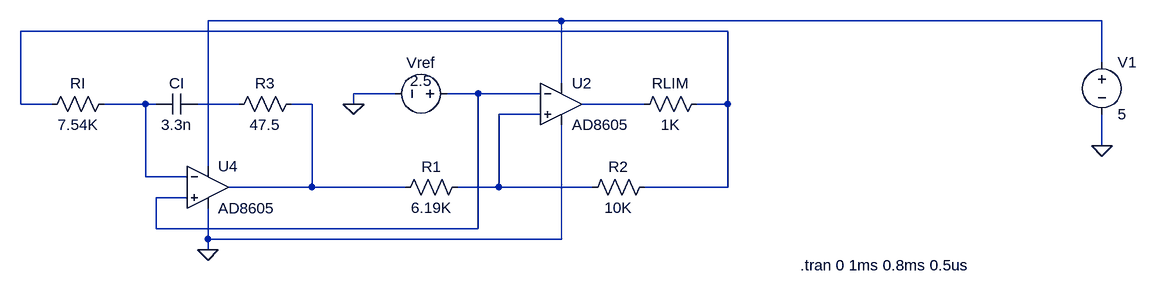
[diagram p0: schematic triangle_gen_final_ad8605.asc]
triangle_gen_final_ad8605.asc, the LTspice schematic file:
Version 4.1
SHEET 1 1528 680
WIRE 640 -48 96 -48
WIRE 1472 -48 640 -48
WIRE 896 -32 -192 -32
WIRE 1472 16 1472 -48
WIRE 640 48 640 -48
WIRE 384 64 320 64
WIRE 512 64 464 64
WIRE 608 64 512 64
WIRE -192 80 -192 -32
WIRE -144 80 -192 80
WIRE 0 80 -64 80
WIRE 16 80 0 80
WIRE 144 80 80 80
WIRE 256 80 224 80
WIRE 320 80 320 64
WIRE 768 80 672 80
WIRE 896 80 896 -32
WIRE 896 80 848 80
WIRE 608 96 544 96
WIRE 1472 144 1472 96
WIRE 96 176 96 -48
WIRE 0 192 0 80
WIRE 64 192 0 192
WIRE 256 208 256 80
WIRE 256 208 128 208
WIRE 400 208 256 208
WIRE 544 208 544 96
WIRE 544 208 480 208
WIRE 688 208 544 208
WIRE 896 208 896 80
WIRE 896 208 768 208
WIRE 64 224 16 224
WIRE 16 272 16 224
WIRE 512 272 512 64
WIRE 512 272 16 272
WIRE 96 288 96 240
WIRE 640 288 640 112
WIRE 640 288 96 288
WIRE 96 304 96 288
FLAG 320 80 0
FLAG 1472 144 0
FLAG 96 304 0
SYMBOL cap 80 64 R90
WINDOW 0 0 32 VBottom 2
WINDOW 3 32 32 VTop 2
SYMATTR InstName CI
SYMATTR Value 3.3n
SYMATTR SpiceLine V=50 Irms=0 Rser=0 Lser=0
SYMBOL res -48 64 R90
WINDOW 0 0 56 VBottom 2
WINDOW 3 32 56 VTop 2
SYMATTR InstName RI
SYMATTR Value 7.54K
SYMATTR SpiceLine tol=1 pwr=0.1
SYMBOL res 864 64 R90
WINDOW 0 0 56 VBottom 2
WINDOW 3 32 56 VTop 2
SYMATTR InstName RLIM
SYMATTR Value 1K
SYMATTR SpiceLine tol=1 pwr=0.1
SYMBOL res 784 192 R90
WINDOW 0 0 56 VBottom 2
WINDOW 3 32 56 VTop 2
SYMATTR InstName R2
SYMATTR Value 10K
SYMATTR SpiceLine tol=1 pwr=0.1
SYMBOL res 496 192 R90
WINDOW 0 0 56 VBottom 2
WINDOW 3 32 56 VTop 2
SYMATTR InstName R1
SYMATTR Value 6.19K
SYMATTR SpiceLine tol=1 pwr=0.1
SYMBOL voltage 480 64 R90
WINDOW 0 -32 56 VBottom 2
WINDOW 3 -4 56 VBottom 2
WINDOW 123 0 0 Left 0
WINDOW 39 0 0 Left 0
SYMATTR InstName Vref
SYMATTR Value 2.5
SYMBOL voltage 1472 0 R0
WINDOW 123 0 0 Left 0
WINDOW 39 0 0 Left 0
SYMATTR InstName V1
SYMATTR Value 5
SYMBOL res 240 64 R90
WINDOW 0 0 56 VBottom 2
WINDOW 3 32 56 VTop 2
SYMATTR InstName R3
SYMATTR Value 47.5
SYMATTR SpiceLine tol=1 pwr=0.1
SYMBOL OpAmps\\AD8605 640 16 R0
SYMATTR InstName U2
SYMBOL OpAmps\\AD8605 96 144 R0
SYMATTR InstName U4
TEXT 1008 328 Left 2 !.tran 0 1ms 0.8ms 0.5us

The netlist it stands for:
* triangle_gen_final_ad8605.asc
CI N005 N004 3.3n V=50 Irms=0 Rser=0 Lser=0
RI N004 N002 7.54K tol=1 pwr=0.1
RLIM N002 N007 1K tol=1 pwr=0.1
R2 N002 N008 10K tol=1 pwr=0.1
R1 N008 N006 6.19K tol=1 pwr=0.1
Vref N003 0 2.5
V1 N001 0 5
R3 N006 N005 47.5 tol=1 pwr=0.1
X§U2 N008 N003 N001 0 N007 AD8605  ; pins In+ In- V+ V- OUT
X§U4 N003 N004 N001 0 N006 AD8605  ; pins In+ In- V+ V- OUT
.tran 0 1ms 0.8ms 0.5us
.lib ADI.lib
.backanno
.end